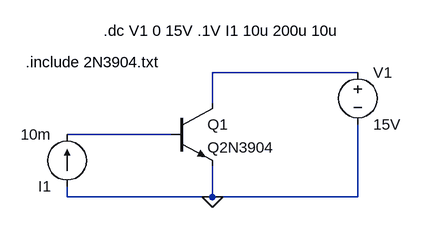
[diagram p0: schematic Transistor charactersitics 2N3904.asc]
Transistor charactersitics 2N3904.asc, the LTspice schematic file:
Version 4
SHEET 1 880 680
WIRE 464 96 240 96
WIRE 240 144 240 96
WIRE 176 192 16 192
WIRE 16 288 16 272
WIRE 240 288 240 240
WIRE 240 288 16 288
WIRE 464 288 464 176
WIRE 464 288 240 288
FLAG 240 288 0
SYMBOL npn 176 144 R0
SYMATTR InstName Q1
SYMATTR Value Q2N3904
SYMBOL voltage 464 80 R0
WINDOW 123 0 0 Left 2
WINDOW 39 0 0 Left 2
SYMATTR InstName V1
SYMATTR Value 15V
SYMBOL current 16 272 R180
WINDOW 123 0 0 Left 2
WINDOW 39 0 0 Left 2
SYMATTR InstName I1
SYMATTR Value 10m
TEXT 72 32 Left 2 !.dc V1 0 15V .1V I1 10u 200u 10u
TEXT -48 80 Left 2 !.include 2N3904.txt

The netlist it stands for:
* Transistor charactersitics 2N3904.asc
Q1 N001 N002 0 0 Q2N3904
V1 N001 0 15V
I1 0 N002 10m
.model NPN NPN
.model PNP PNP
.lib standard.bjt
.dc V1 0 15V .1V I1 10u 200u 10u
.include 2N3904.txt
.backanno
.end